# EAGLE design esprog (EAGLE 6.4)
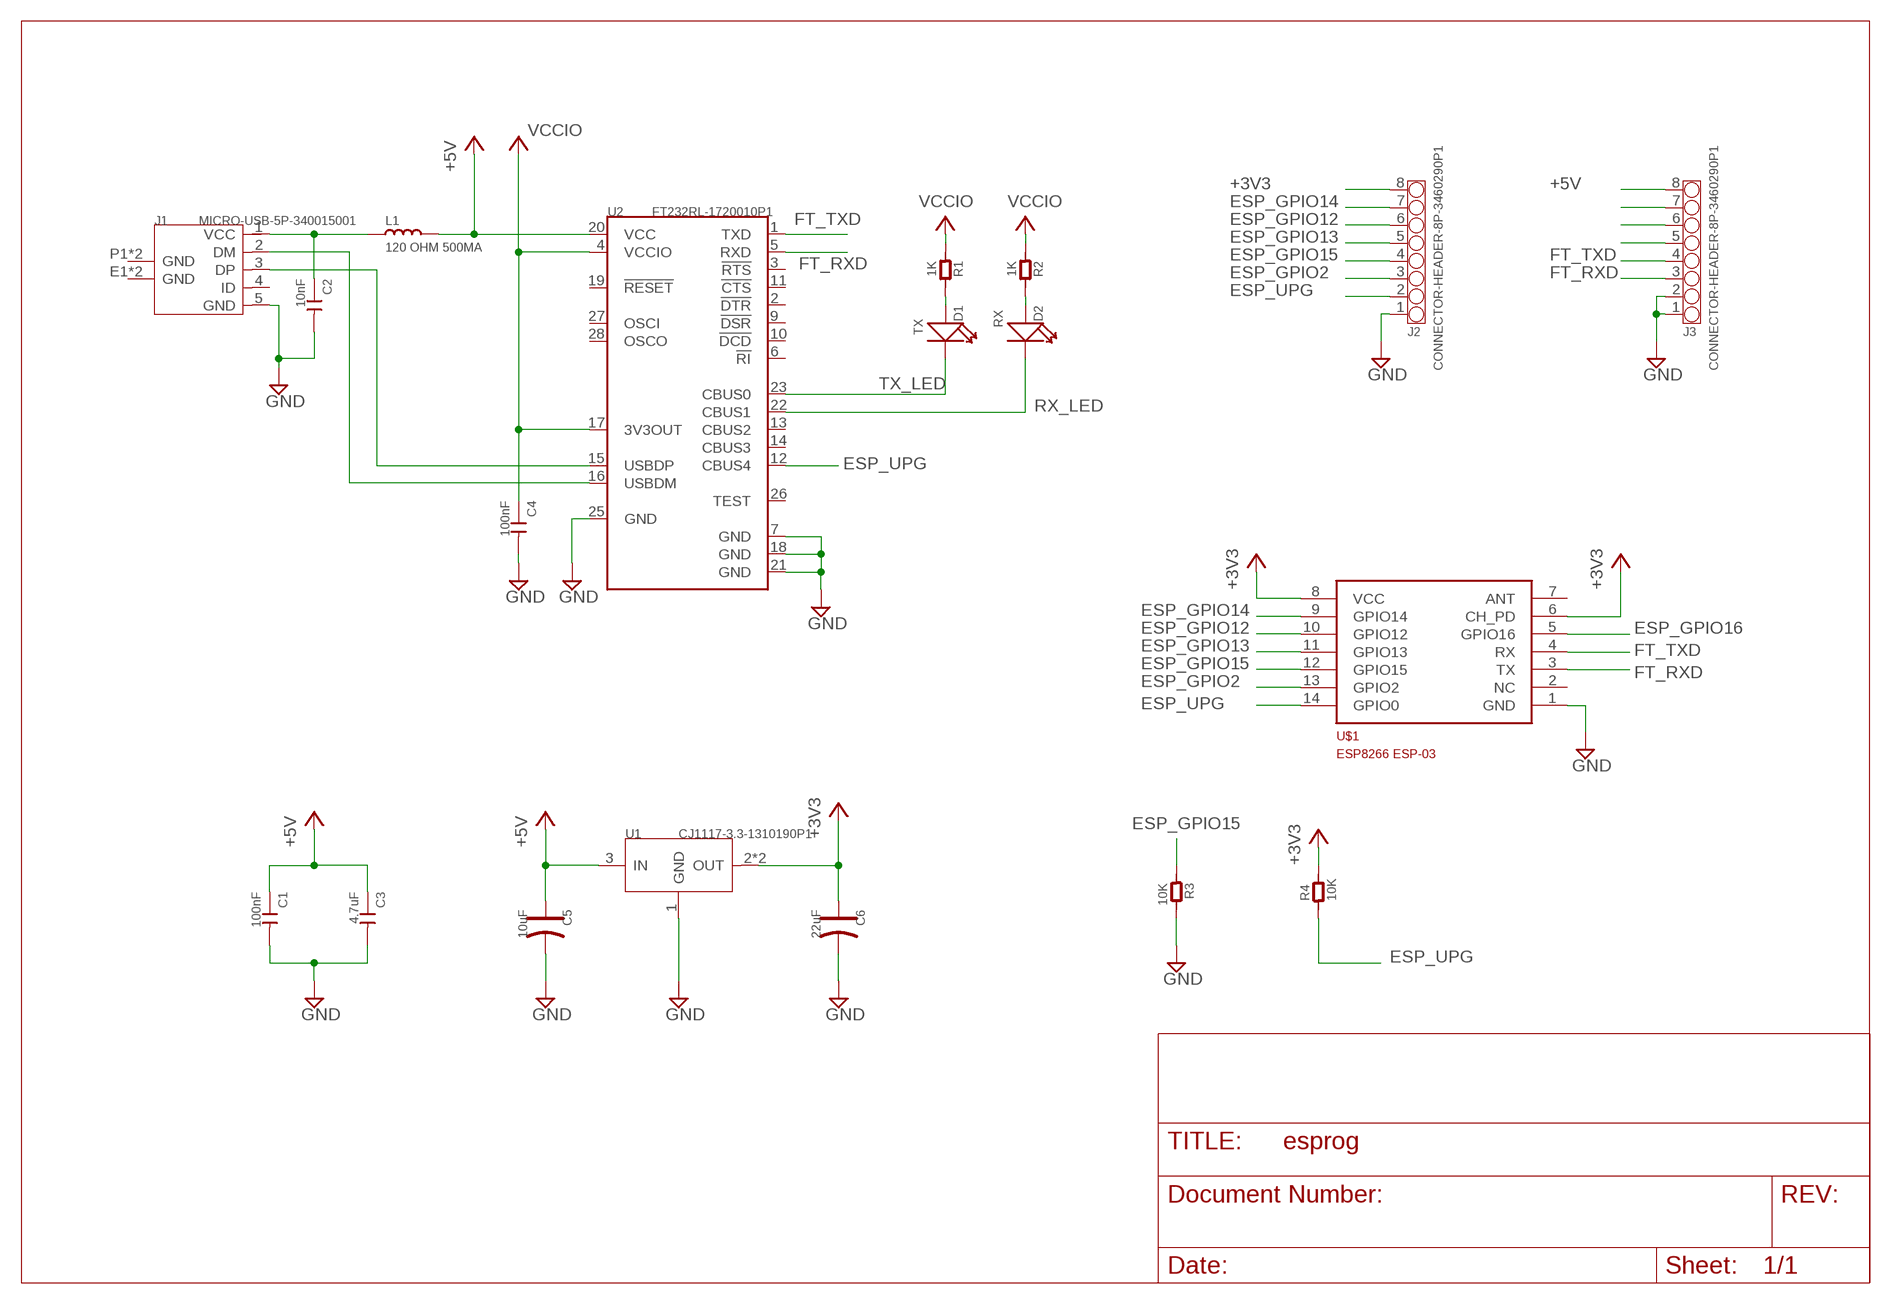
[diagram p0: schematic, sheet 1]

## Parts
C1  100nF  CAP-0603  [C0603]
C2  10nF  CAP-0603  [C0603]
C3  4.7uF  CAP-0805  [C0805]
C4  100nF  CAP-0603  [C0603]
C5  10uF  CAP-POLAR-AVX-B  [AVX-B]
C6  22uF  CAP-POLAR-AVX-B  [AVX-B]
D1  TX  LED-0603  [LED-0603]
D2  RX  LED-0603  [LED-0603]
J1  MICRO-USB-5P-340015001  [B-SMD-5P]
J2  CONNECTOR-HEADER-8P-3460290P1  [1X8P-2.54-8.5-BLACK-FEMALE]
J3  CONNECTOR-HEADER-8P-3460290P1  [1X8P-2.54-8.5-BLACK-FEMALE]
L1  120 OHM 500MA  INDUCTOR/FERRITE-BEAD-0805  [L0805]
R1  1K  R-0805  [R0805]
R2  1K  R-0805  [R0805]
R3  10K  R-0805  [R0805]
R4  10K  R-0805  [R0805]
U1  CJ1117-3.3-1310190P1  [SOT223]
U2  FT232RL-1720010P1  [SSOP28]
U$1  ESP8266_ESP-03  [ESP-03]

## Nets
+3V3: C6.+ J2.8 R4.2 U1.2(OUT) U1.TER(OUT) U$1.6(CH_PD) U$1.8(VCC)
+5V: C1.1 C3.1 C5.+ J3.8 L1.2 U1.3(IN) U2.20(VCC)
DM: J1.2(DM) U2.16(USBDM)
DP: J1.3(DP) U2.15(USBDP)
ESP_GPIO2: J2.3 U$1.13(GPIO2)
ESP_GPIO12: J2.6 U$1.10(GPIO12)
ESP_GPIO13: J2.5 U$1.11(GPIO13)
ESP_GPIO14: J2.7 U$1.9(GPIO14)
ESP_GPIO15: J2.4 R3.1 U$1.12(GPIO15)
ESP_GPIO16: U$1.5(GPIO16)
ESP_UPG: J2.2 R4.1 U2.12(CBUS4) U$1.14(GPIO0)
FT_RXD: J3.3 U2.5(RXD) U$1.3(TX)
FT_TXD: J3.4 U2.1(TXD) U$1.4(RX)
GND: C1.2 C2.2 C3.2 C4.2 C5.- C6.- J1.5(GND) J2.1 J3.1 J3.2 R3.2 U1.1(GND) U2.7(GND) U2.18(GND) U2.21(GND) U2.25(GND) U$1.1(GND)
N$1: D1.+ R1.2
N$3: J3.7
N$4: J3.6
N$5: J3.5
N$7: D2.+ R2.2
RX_LED: D2.- U2.22(CBUS1)
TX_LED: D1.- U2.23(CBUS0)
VCCIO: C4.1 R1.1 R2.1 U2.4(VCCIO) U2.17(3V3OUT)
VUSB: C2.1 J1.1(VCC) L1.1
Unconnected: J1.4(ID) J1.E1(GND) J1.E2(GND) J1.P1(GND) J1.P2(GND) U2.2(!DTR) U2.3(!RTS) U2.6(!RI) U2.9(!DSR) U2.10(!DCD) U2.11(!CTS) U2.13(CBUS2) U2.14(CBUS3) U2.19(!RESET) U2.26(TEST) U2.27(OSCI) U2.28(OSCO) U$1.2(NC) U$1.7(ANT)

## Library data of the parts
C1-C4 = Discrete:CAP: Ceramic Capacitors
C5 C6 = Discrete:CAP-POLAR: Electrolytic Capacitors,Tantalum Capacitors and Super Capacitors
D1 D2 = Discrete:LED
J1 = Connector:MICRO-USB-5P: When you use the footprint ,place notice 46 (layer)milling ,there is some important information.
J2 J3 = Connector:CONNECTOR-HEADER-8P
L1 = Discrete:INDUCTOR/FERRITE-BEAD
R1-R4 = Discrete:R*
U1 = IC:CJ1117-3.3: 1A Low Dropout Linear Regulator
U2 = IC:FT232RL: USB UART IC Source: http://www.ftdichip.com/Documents/DataSheets/DS_FT232R_v104.pdf
U$1 = ESP8266:ESP8266_ESP-03

## Board
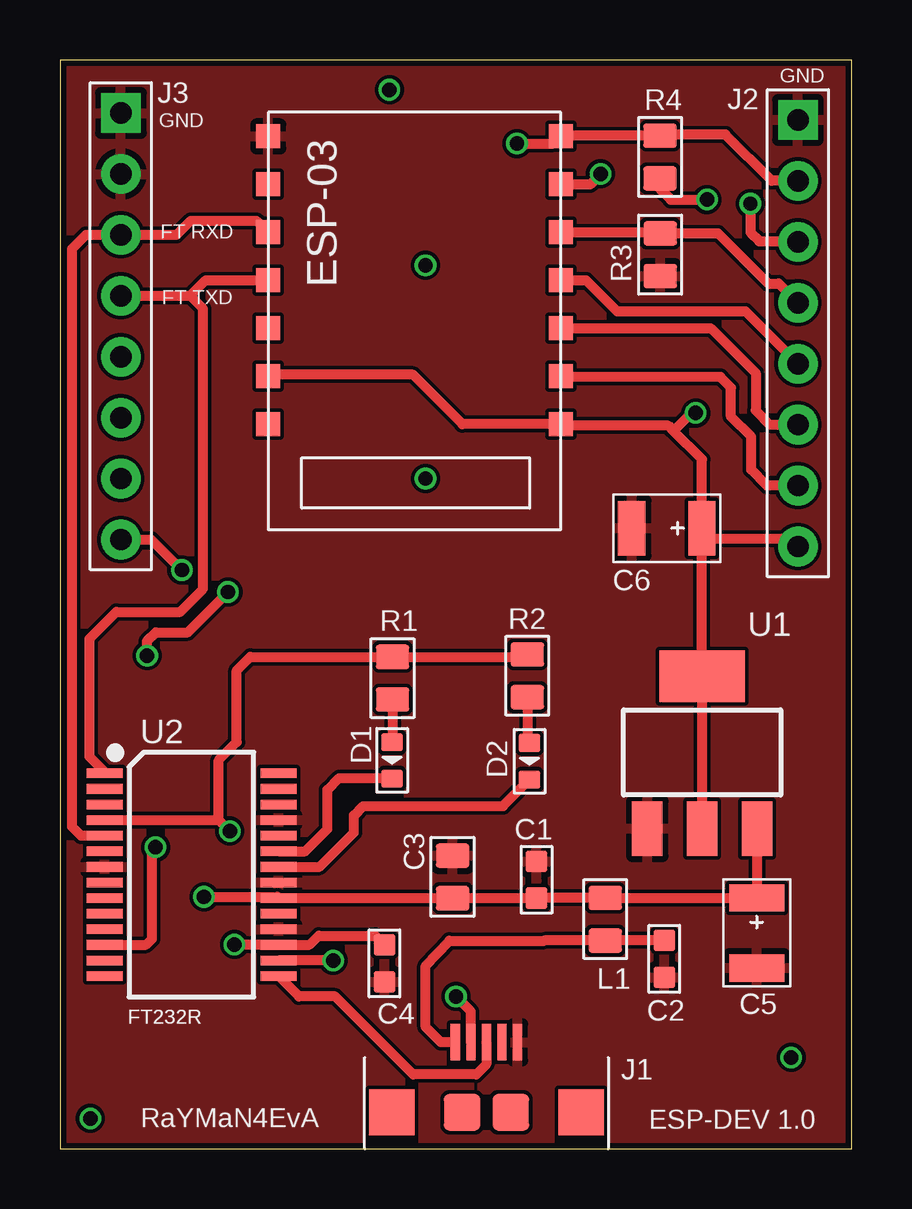
[diagram p1: board, top side]
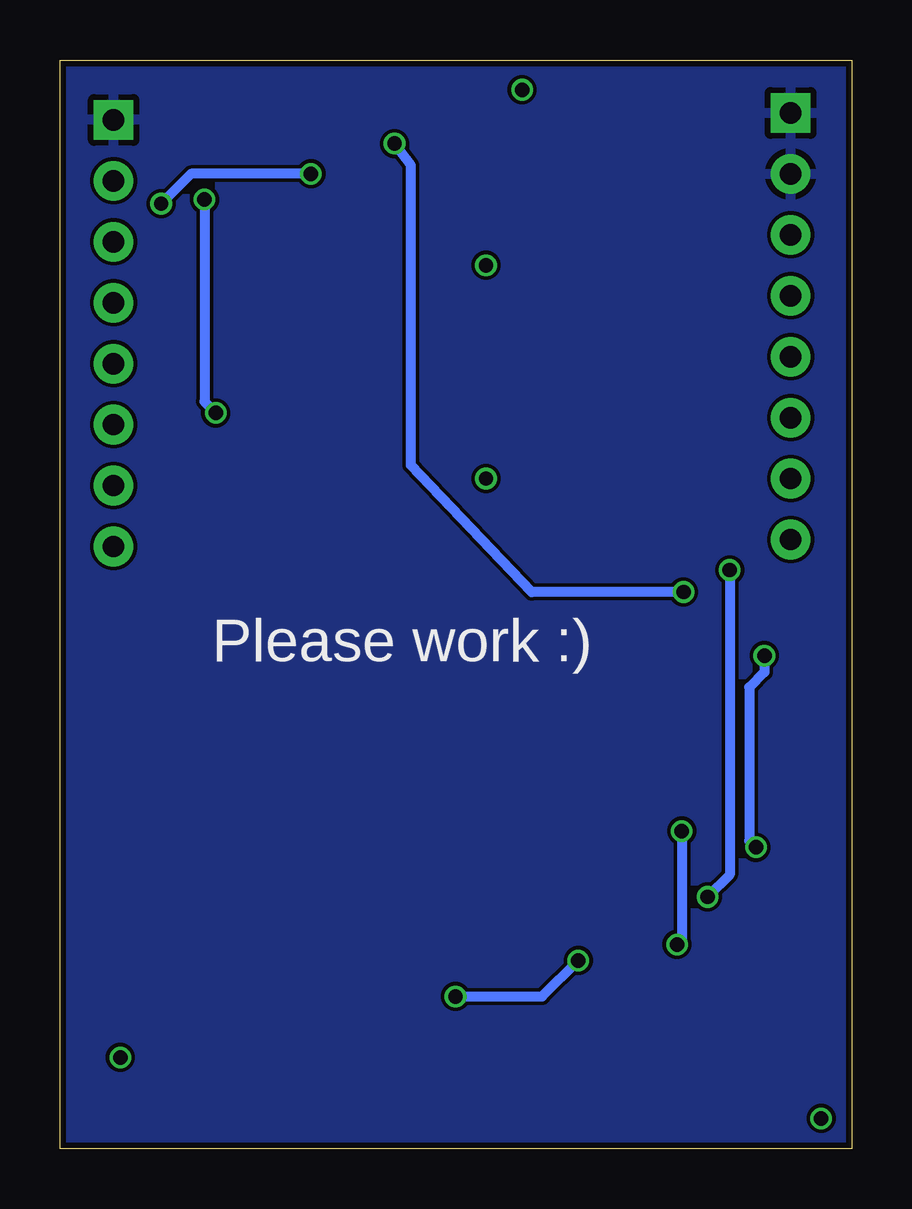
[diagram p2: board, bottom side, seen from below]

Size 33 x 45.39 mm. Coordinates in mm from the lower left corner, seen from the top.
Outline: 0,0 33,0 33,45.39 0,45.39 0,0
Copper layers (1*16): Top 0.035mm / dielectric 1.5mm / Bottom 0.035mm
Design rules "SeeedStudio_2layer_DRU_no_angle_20140221": minimum track width 6mil, minimum drill 12mil, track to track 6mil, track to pad 6mil, pad to pad 6mil, via to via 6mil, smd to smd 0mil, copper to edge 10mil, drill to drill 10mil, minimum pad ring 10mil, minimum via ring 6mil, stop-mask expansion 2mil, vias tented up to drill 100mil, thermal gap 10mil

### Footprints (pad centres in the part's own frame; a part is rotated, then mirrored left to right if it is on the bottom)
C0603 = smd 0.889 x 0.889: 1 -0.762,0; 2 0.762,0
C0805 = smd 1.016 x 1.397: 1 -0.889,0; 2 0.889,0
AVX-B = smd 1.143 x 2.286: + -1.46,0; - 1.46,0
LED-0603 = smd 0.762 x 0.889: + -0.762,0; - 0.762,0
B-SMD-5P = smd 0.38 x 1.52: 1 -1.3,2.54; 2 -0.65,2.54; 3 0,2.54; 4 0.65,2.54; 5 1.3,2.54 | smd 1.524 x 1.524: E1 -1.016,-0.381; E2 1.016,-0.381 | smd 1.9 x 1.9: P1 -3.95,-0.381; P2 3.95,-0.381
1X8P-2.54-8.5-BLACK-FEMALE = drill 0.889 pad 1.651 square: 1 0,8.89 | drill 0.889 pad 1.651: 2 0,6.35; 3 0,3.81; 4 0,1.27; 5 0,-1.27; 6 0,-3.81; 7 0,-6.35; 8 0,-8.89
L0805 = smd 1.016 x 1.397: 1 -0.889,0; 2 0.889,0
R0805 = smd 1.016 x 1.397: 1 -0.889,0; 2 0.889,0
SOT223 = smd 1.27 x 2.286: 1 -2.286,-3.175; 2 0,-3.175; 3 2.286,-3.175 | smd 3.556 x 2.159: TER 0,3.175
SSOP28 = smd 1.5 x 0.4: 1 -3.625,4.225; 2 -3.625,3.575; 3 -3.625,2.925; 4 -3.625,2.275; 5 -3.625,1.625; 6 -3.625,0.975; 7 -3.625,0.325; 8 -3.625,-0.325; 9 -3.625,-0.975; 10 -3.625,-1.625; 11 -3.625,-2.275; 12 -3.625,-2.925; 13 -3.625,-3.575; 14 -3.625,-4.225; 15 3.625,-4.225; 16 3.625,-3.575; 17 3.625,-2.925; 18 3.625,-2.275; 19 3.625,-1.625; 20 3.625,-0.975; 21 3.625,-0.325; 22 3.625,0.325; 23 3.625,0.975; 24 3.625,1.625; 25 3.625,2.275; 26 3.625,2.925; 27 3.625,3.575; 28 3.625,4.225
ESP-03 = smd 1 x 1: 1 6.2,-7; 2 6.2,-5; 3 6.2,-3; 4 6.2,-1; 5 6.2,1; 6 6.2,3; 7 6.2,5; 8 -6,5; 9 -6,3; 10 -6,1; 11 -6,-1; 12 -6,-3; 13 -6,-5; 14 -6,-7

### Placement (x,y rotation side)
C1  19.87,11.21 90 top
C2  25.19,7.92 270 top
C3  16.37,11.34 90 top
C4  13.53,7.73 270 top
C5  29.05,9 270 top
C6  25.3,25.87 180 top
D1  13.85,16.19 270 top
D2  19.58,16.16 270 top
J1  17.78,1.91 0 top
J2  30.76,34 0 top
J3  2.54,34.29 0 top
L1  22.73,9.57 90 top
R1  13.86,19.62 270 top
R2  19.48,19.72 270 top
R3  25.02,37.27 270 top
R4  25.02,41.35 270 top
U1  26.77,16.52 0 top
U2  5.48,11.43 0 top
U$1  14.88,35.21 180 top

### Tracks (layer width: path | path; a pad name or v marks a point on that pad's centre or on a via)
+3V3  (via drill 0.6)
  Top 0.406: U1.2 U1.TER C6.+ | J2.8 30.45,25.42 27.21,25.42 C6.+ | C6.+ 26.76,28.75 25.58,29.93 | 25.58,29.93 25.36,30.15 20.94,30.15 U$1.8 16.78,30.21 14.72,32.27 8.74,32.27 U$1.6 | v26.5,30.68 26.33,30.68 25.58,29.93 | R4.2 25.02,40.01 25.46,39.57 v26.97,39.57 v26.98,39.57
  Bottom 0.406: v26.98,39.57 26.98,31.15 v26.5,30.68
+5V  (via drill 0.6)
  Top 0.406: U1.3 C5.+ | 9.11,10.45 U2.20 | J3.8 3.81,25.4 v5.08,24.13 | v6,10.51 9.05,10.51 U2.20 | C5.+ L1.2 19.88,10.46 C1.1 C3.1 U2.20 | C5.+
  Bottom 0.406: v5.08,24.13 5.08,11.43 v6,10.51
DM  (via drill 0.6)
  Top 0.406: J1.2 17.13,5.73 v16.51,6.35 | v11.39,7.85 U2.16
  Bottom 0.406: v16.51,6.35 12.9,6.35 v11.39,7.85
DP
  Top 0.406: J1.3 17.78,3.53 17.36,3.1 14.72,3.1 11.47,6.35 9.96,6.35 U2.15
ESP_GPIO2  (via drill 0.6)
  Top 0.406: U$1.13 22.11,40.21 v22.54,40.64 | v28.78,39.4 28.78,38.2 29.15,37.83 30.75,37.83 J2.3
  Bottom 0.406: v22.54,40.64 27.54,40.64 v28.78,39.4
ESP_GPIO12
  Top 0.406: U$1.10 27.13,34.21 29,32.34 29,30.78 29.58,30.2 J2.6
ESP_GPIO13
  Top 0.406: U$1.11 21.93,36.21 23.23,34.91 28.58,34.91 J2.5
ESP_GPIO14
  Top 0.406: J2.7 29.48,27.65 28.82,28.31 28.82,29.68 27.98,30.52 27.98,31.73 27.54,32.18 20.91,32.18 U$1.9
ESP_GPIO15
  Top 0.406: U$1.12 24.97,38.21 R3.1 27.43,38.16 29.52,36.07 29.96,36.07 J2.4
ESP_UPG  (via drill 0.6)
  Top 0.406: J2.2 29.67,40.35 27.74,42.28 25.06,42.28 R4.1 20.9,42.23 U$1.14 20.57,41.91 v19.05,41.91 | U2.12 3.59,8.51 3.84,8.75 3.84,12.43 v3.98,12.57 | v3.63,20.56 3.63,21.16 4,21.54 5.33,21.54 v7.01,23.21
  Bottom 0.406: v7.01,23.21 13.34,23.21 18.38,28.5 18.38,40.99 18.37,40.99 v19.05,41.91 | v3.63,20.56 3.63,19.87 4.26,19.24 4.26,12.86 v3.98,12.57
FT_RXD
  Top 0.406: 8.56,38.1 U$1.3 8.2,38.69 5.46,38.69 4.86,38.1 J3.3 | U2.5 0.88,13.05 0.51,13.43 0.51,37.52 1.09,38.1 J3.3 | J3.3
FT_TXD
  Top 0.406: J3.4 5.43,35.56 | 5.43,35.56 6.08,36.2 U$1.4 | U2.1 1.86,15.72 1.24,16.34 1.24,21.27 2.35,22.39 5.01,22.39 5.97,23.34 5.97,35.02 5.43,35.56
GND
  pour Top: 0,45.72 33.02,45.72 33.02,0 0,0
  pour Bottom: 0,45.72 33.02,45.72 33.02,0 0,0
N$1
  Top 0.406: R1.2 13.86,16.97 D1.+
N$2  (via drill 0.6)
  other vias: 1.27,1.27
N$6  (via drill 0.6)
  other vias: 15.24,27.94
N$7
  Top 0.406: R2.2 19.48,17.01 D2.+
N$8  (via drill 0.6)
  other vias: 13.73,44.15
N$9  (via drill 0.6)
  other vias: 15.24,36.83
N$10  (via drill 0.6)
  other vias: 30.48,3.81
RX_LED
  Top 0.406: U2.22 10.82,11.76 12.25,13.19 12.25,13.9 12.64,14.29 18.47,14.29 D2.-
TX_LED
  Top 0.406: U2.23 10.22,12.4 11.15,13.34 11.15,14.97 11.64,15.45 13.82,15.45 D1.-
VCCIO  (via drill 0.6)
  Top 0.406: R1.1 19.39,20.51 R2.1 | C4.1 13.14,8.88 10.78,8.88 10.4,8.51 U2.17 9.1,8.52 v7.27,8.52 | U2.4 6.62,13.71 | 6.62,13.71 v7.08,13.25 | 6.62,13.71 6.62,16.21 7.37,16.96 7.37,19.95 7.93,20.51 R1.1 | R1.1
  Bottom 0.406: v7.08,13.25 7.08,8.71 v7.27,8.52
VUSB
  Top 0.406: J1.1 15.88,4.45 15.24,5.08 15.24,7.62 16.23,8.68 20.19,8.68 L1.1 | C2.1 L1.1 | L1.1

### Text on the board
tNames: GND | GND | FT RXD | FT TXD | U1 | U2 | FT232R | FT232R | RaYMaN4EvA | ESP-DEV 1.0
bNames: Please work :)